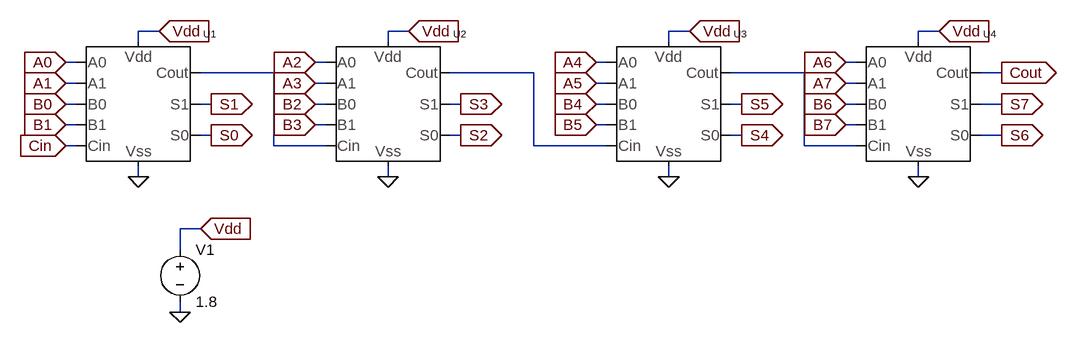
[diagram p0: schematic 8_Bit_CLA.asc]
8_Bit_CLA.asc, the LTspice schematic file:
Version 4
SHEET 1 1648 680
WIRE 240 32 208 32
WIRE 624 32 592 32
WIRE 1056 32 1024 32
WIRE 1440 32 1408 32
WIRE 208 48 208 32
WIRE 592 48 592 32
WIRE 1024 48 1024 32
WIRE 1408 48 1408 32
WIRE 112 80 96 80
WIRE 496 80 480 80
WIRE 928 80 912 80
WIRE 1312 80 1296 80
WIRE 416 96 304 96
WIRE 816 96 688 96
WIRE 1232 96 1120 96
WIRE 1536 96 1504 96
WIRE 112 112 96 112
WIRE 496 112 480 112
WIRE 928 112 912 112
WIRE 1312 112 1296 112
WIRE 112 144 96 144
WIRE 320 144 304 144
WIRE 496 144 480 144
WIRE 704 144 688 144
WIRE 928 144 912 144
WIRE 1136 144 1120 144
WIRE 1312 144 1296 144
WIRE 1536 144 1504 144
WIRE 112 176 96 176
WIRE 496 176 480 176
WIRE 928 176 912 176
WIRE 1312 176 1296 176
WIRE 320 192 304 192
WIRE 704 192 688 192
WIRE 1136 192 1120 192
WIRE 1536 192 1504 192
WIRE 112 208 96 208
WIRE 416 208 416 96
WIRE 496 208 416 208
WIRE 816 208 816 96
WIRE 928 208 816 208
WIRE 1232 208 1232 96
WIRE 1312 208 1232 208
WIRE 208 256 208 240
WIRE 592 256 592 240
WIRE 1024 256 1024 240
WIRE 1408 256 1408 240
WIRE 304 336 272 336
WIRE 272 368 272 336
WIRE 272 464 272 448
FLAG 208 256 0
FLAG 592 256 0
FLAG 240 32 Vdd
IOPIN 240 32 In
FLAG 624 32 Vdd
IOPIN 624 32 In
FLAG 96 80 A0
IOPIN 96 80 In
FLAG 96 112 A1
IOPIN 96 112 In
FLAG 96 144 B0
IOPIN 96 144 In
FLAG 96 176 B1
IOPIN 96 176 In
FLAG 96 208 Cin
IOPIN 96 208 In
FLAG 480 80 A2
IOPIN 480 80 In
FLAG 480 112 A3
IOPIN 480 112 In
FLAG 480 144 B2
IOPIN 480 144 In
FLAG 480 176 B3
IOPIN 480 176 In
FLAG 320 144 S1
IOPIN 320 144 Out
FLAG 320 192 S0
IOPIN 320 192 Out
FLAG 1024 256 0
FLAG 1408 256 0
FLAG 1056 32 Vdd
IOPIN 1056 32 In
FLAG 1440 32 Vdd
IOPIN 1440 32 In
FLAG 912 80 A4
IOPIN 912 80 In
FLAG 912 112 A5
IOPIN 912 112 In
FLAG 912 144 B4
IOPIN 912 144 In
FLAG 912 176 B5
IOPIN 912 176 In
FLAG 1296 80 A6
IOPIN 1296 80 In
FLAG 1296 112 A7
IOPIN 1296 112 In
FLAG 1296 144 B6
IOPIN 1296 144 In
FLAG 1296 176 B7
IOPIN 1296 176 In
FLAG 1136 144 S5
IOPIN 1136 144 Out
FLAG 1136 192 S4
IOPIN 1136 192 Out
FLAG 704 192 S2
IOPIN 704 192 Out
FLAG 704 144 S3
IOPIN 704 144 Out
FLAG 1536 144 S7
IOPIN 1536 144 Out
FLAG 1536 192 S6
IOPIN 1536 192 Out
FLAG 1536 96 Cout
IOPIN 1536 96 Out
FLAG 272 464 0
FLAG 304 336 Vdd
IOPIN 304 336 In
SYMBOL 2_Bit_CLA 208 144 R0
SYMATTR InstName U1
SYMBOL 2_Bit_CLA 592 144 R0
SYMATTR InstName U2
SYMBOL 2_Bit_CLA 1024 144 R0
SYMATTR InstName U3
SYMBOL 2_Bit_CLA 1408 144 R0
SYMATTR InstName U4
SYMBOL voltage 272 352 R0
WINDOW 123 0 0 Left 0
WINDOW 39 0 0 Left 0
SYMATTR InstName V1
SYMATTR Value 1.8

The netlist it stands for:
* 8_Bit_CLA.asc
XU1 A0 A1 B0 B1 Cin N001 S1 S0 Vdd 0 2_Bit_CLA  ; pins A0 A1 B0 B1 Cin Cout S1 S0 Vdd Vss
XU2 A2 A3 B2 B3 N001 N002 S3 S2 Vdd 0 2_Bit_CLA  ; pins A0 A1 B0 B1 Cin Cout S1 S0 Vdd Vss
XU3 A4 A5 B4 B5 N002 N003 S5 S4 Vdd 0 2_Bit_CLA  ; pins A0 A1 B0 B1 Cin Cout S1 S0 Vdd Vss
XU4 A6 A7 B6 B7 N003 Cout S7 S6 Vdd 0 2_Bit_CLA  ; pins A0 A1 B0 B1 Cin Cout S1 S0 Vdd Vss
V1 Vdd 0 1.8
.lib 2_Bit_CLA.sub
.backanno
.end